# Altium schematic sheet RF part v13.SchDoc: MiniPCIe XTRX to PCIe x4 Carrier Board
size A4 portrait; CompanyName: Fairwaves Inc; DrawnBy: Andrey Sviyazov; Revision: 2; SheetNumber: 2; SheetTotal: 2
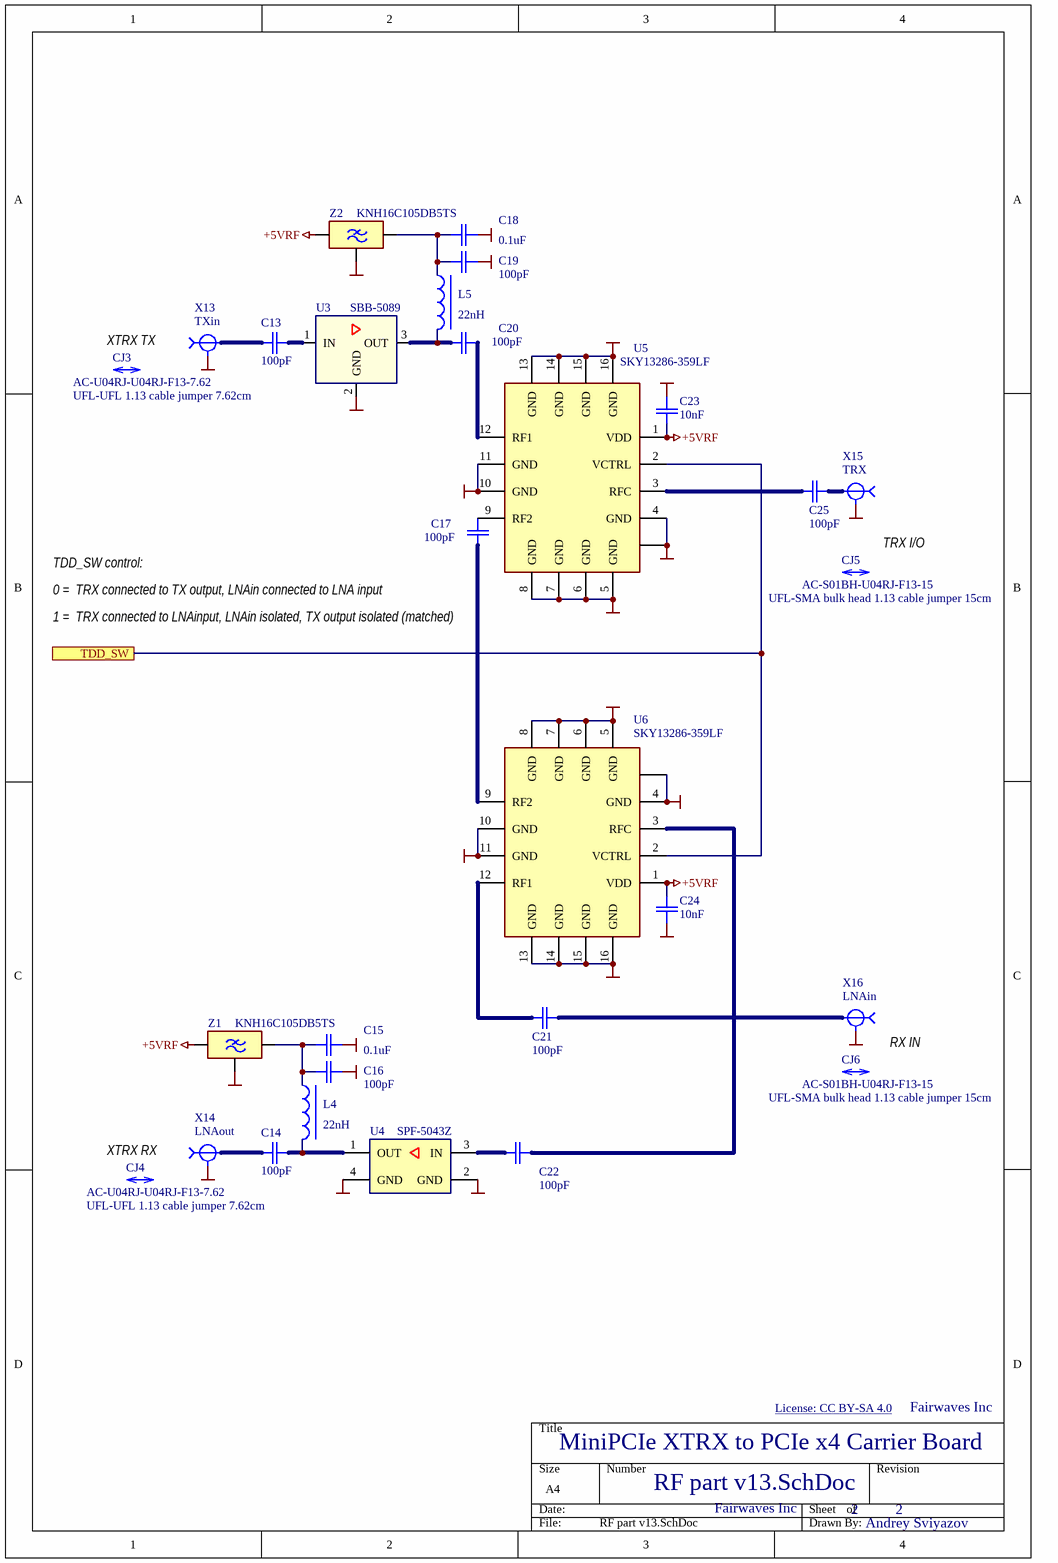
[diagram p0: RF part v13.SchDoc]

## Parts
C13  100pF  [C0603-PHILLIPS]
C14  100pF  [C0603-PHILLIPS]
C15  0.1uF  [C0603-PHILLIPS]
C16  100pF  [C0603-PHILLIPS]
C17  100pF  [C0603-PHILLIPS]
C18  0.1uF  [C0603-PHILLIPS]
C19  100pF  [C0603-PHILLIPS]
C20  100pF  [C0603-PHILLIPS]
C21  100pF  [C0603-PHILLIPS]
C22  100pF  [C0603-PHILLIPS]
C23  10nF  [C0603-PHILLIPS]
C24  10nF  [C0603-PHILLIPS]
C25  100pF  [C0603-PHILLIPS]
CJ3  AC-U04RJ-U04RJ-F13-7.62  Misc: UFL-UFL 1.13 cable jumper 7.62cm  (mechanical)
CJ4  AC-U04RJ-U04RJ-F13-7.62  Misc: UFL-UFL 1.13 cable jumper 7.62cm  (mechanical)
CJ5  AC-S01BH-U04RJ-F13-15  Misc: UFL-SMA bulk head 1.13 cable jumper 15cm  (mechanical)
CJ6  AC-S01BH-U04RJ-F13-15  Misc: UFL-SMA bulk head 1.13 cable jumper 15cm  (mechanical)
L4  22nH  [TF160808-Phillips]
L5  22nH  [TF160808-Phillips]
U3  SBB-5089  [SOT89]
U4  SPF-5043Z  [SOT-343[2X1.25]]
U5  SKY13286-359LF  [QFN16(4x4/0.65mm) SQ]
U6  SKY13286-359LF  [QFN16(4x4/0.65mm) SQ]
X13  Misc: TXin  [U_FL]  (hidden comment: 0734120110)
X14  Misc: LNAout  [U_FL]  (hidden comment: 0734120110)
X15  Misc: TRX  [U_FL]  (hidden comment: 0734120110)
X16  Misc: LNAin  [U_FL]  (hidden comment: 0734120110)
Z1  KNH16C105DB5TS  [KNH16 - DB Serie]
Z2  KNH16C105DB5TS  [KNH16 - DB Serie]

## Ports
TDD_SW

## Nets
+5VRF: C23.1 C24.1 U5.1(VDD) U6.1(VDD) Z1.1 Z2.1
GND: C15.2 C16.2 C18.2 C19.2 C23.2 C24.2 U3.2(GND) U4.2(GND) U4.4(GND) U5.0(PAD) U5.4(GND) U5.5(GND) U5.6(GND) U5.7(GND) U5.8(GND) U5.10(GND) U5.11(GND) U5.13(GND) U5.14(GND) U5.15(GND) U5.16(GND) U6.0(PAD) U6.4(GND) U6.5(GND) U6.6(GND) U6.7(GND) U6.8(GND) U6.10(GND) U6.11(GND) U6.13(GND) U6.14(GND) U6.15(GND) U6.16(GND) X13.2(GND) X14.2(GND) X15.2(GND) X16.2(GND) Z1.2 Z2.2
TDD_SW: U5.2(VCTRL) U6.2(VCTRL) ; port TDD_SW
NetC13_1: C13.1 X13.1
NetC13_2: C13.2 U3.1(IN)
NetC14_1: C14.1 X14.1
NetC14_2: C14.2 L4.2 U4.1(OUT)
NetC15_1: C15.1 C16.1 L4.1 Z1.3
NetC17_1: C17.1 U6.9(RF2)
NetC17_2: C17.2 U5.9(RF2)
NetC18_1: C18.1 C19.1 L5.1 Z2.3
NetC20_1: C20.1 L5.2 U3.3(OUT)
NetC20_2: C20.2 U5.12(RF1)
NetC21_1: C21.1 U6.12(RF1)
NetC21_2: C21.2 X16.1
NetC22_1: C22.1 U4.3(IN)
NetC22_2: C22.2 U6.3(RFC)
NetC25_1: C25.1 U5.3(RFC)
NetC25_2: C25.2 X15.1

Not connected (* = marked no-connect by the designer): CJ3 ?1; CJ4 ?1; CJ5 ?1; CJ6 ?1

## Notes on the sheet
- (near CJ3) XTRX TX
- TDD_SW control:
- TRX I/O
- (near U5) 0 =  TRX connected to TX output, LNAin connected to LNA input
- (near U5) 1 =  TRX connected to LNAinput, LNAin isolated, TX output isolated (matched)
- RX IN
- (near CJ4) XTRX RX
- License: CC BY-SA 4.0 <https://creativecommons.org/licenses/by-sa/4.0/>

## Library data of the parts
C13 C14 C16 C17 C19-C22 C25 = C0603: Capacitor; Manufacturer: MURATA; Tolerance: 20%; Name: SMD0603; U/P/TKE: NP0; Value: 100pF
C15 C18 C23 C24 = C0603: Capacitor; Manufacturer: MURATA; Tolerance: 20%; Name: SMD0603; U/P/TKE: X7R
  C15 C18: Value: 0.1uF
  C23 C24: Value: 10nF
CJ3-CJ6 = Mating part: Cable jumper; Manufacturer: RFSupplier
  CJ3 CJ4: Name: AC-U04RJ-U04RJ-F13-7.62; Link: https://rfsupplier.com/customcable.html
  CJ5 CJ6: Name: AC-S01BH-U04RJ-F13-15; Link: https://rfsupplier.com/sma-female-to-ipex-ufl-connector-cable-with-rg113-cbale_p6418.html
L4 L5 = TF160808: Coil; Manufacturer: MuRata; Misc: Self Resonance >4GHz; Name: LQW18AN22NG00D; Value: 22nH; Link: https://octopart.com/lqw18an22ng00d-murata-890271
U3 = SBB-5089: IC; Manufacturer: RFMD; Misc: Gain Block; Swap: No; Name: SBB-5089; Link: https://octopart.com/search?r=sp&s=Om3EEUYtRd-BHyhqotd9rA&q=sbb5089z&oq=SBB5089&start=0
U4 = SPF-5043Z: IC; Manufacturer: RFMD; Swap: No; Name: SPF-5043Z; Link: https://octopart.com/search?q=SPF+5043Z
U5 U6 = SKY13286-359LF: IC RF SPDT Absorptive Switch; Manufacturer: Skyworks; Misc: SPDT 0.1-6 GHz Hi Isol Absorptive Switch; Swap: No; U/P/TKE: 3-5V; Name: SKY13286-359LF; Link: https://octopart.com/sky13286-359lf-skyworks+solutions-3998422
X13-X16 = U_FL: Connector (UMCC); Manufacturer: Molex; Name: 0734120110; Link: https://octopart.com/0734120110-molex-16756629
Z1 Z2 = KNH16 Serie: EMI Filter; Manufacturer: AVX / Kyocera; Misc: Power line EMI Filter 0603 Size; Value: 1uF/10V/2A; Name: KNH16C105DB5TS; Link: https://octopart.com/knh16c105db5ts-avx-21214733